# Altium schematic sheet DSP.SchDoc
size A4
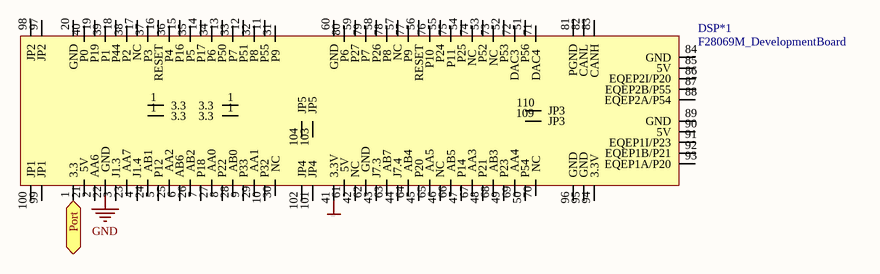
[diagram p0: DSP.SchDoc]

## Parts
DSP*1  F28069M_DevelopmentBoard  [F28069M_DevelopmentBoard]

## Ports
Port

## Nets
GND: DSP*1.22(GND)
VCC: DSP*1.41(3.3V)
Port: DSP*1.1(3.3) ; port Port

Not connected (* = marked no-connect by the designer): DSP*1 2(AA6) 3(J1.3) 4(J1.4) 5(P12) 6(AB6) 7(P18) 8(P22) 9(P33) 10(P32) 11(P55) 12(P51) 13(P50) 14(P17) 15(P16) 16(RESET) 17(NC) 18(P44) 19(P19) 20(GND) 21(5V) 23(AA7) 24(AB1) 25(AA2) 26(AB2) 27(AA0) 28(AB0) 29(AA1) 30(NC) 31(P9) 32(P8) 33(P7) 34(P6) 35(P5) 36(P4) 37(P3) 38(P2) 39(P1) 40(P0) 42(NC) 43(J7.3) 44(J7.4) 45(P20) 46(NC) 47(P14) 48(P21) 49(P23) 50(P54) 51(P56) 52(P53) 53(P52) 54(P25) 55(P24) 56(RESET) 57(NC) 58(P26) 59(P27) 60(GND) 61(5V) 62(GND) 63(AB7) 64(AB4) 65(AA5) 66(AB5) 67(AA3) 68(AB3) 69(AA4) 70(NC) 71(DAC4) 72(DAC3) 73(NC) 74(NC) 75(P11) 76(P10) 77(P9) 78(P8) 79(P7) 80(P6) 81(PGND) 82(CANL) 83(CANH) 84(GND) 85(5V) 86(EQEP2I/P20) 87(EQEP2B/P55) 88(EQEP2A/P54) 89(GND) 90(5V) 91(EQEP1I/P23) 92(EQEP1B/P21) 93(EQEP1A/P20) 94(3.3V) 95(GND) 96(GND) 97(JP2) 98(JP2) 99(JP1) 100(JP1) 101(JP4) 102(JP4) 103(JP5) 104(JP5) 109(JP3) 110(JP3)